# Altium schematic sheet esquematico_ED3.SchDoc
size A4
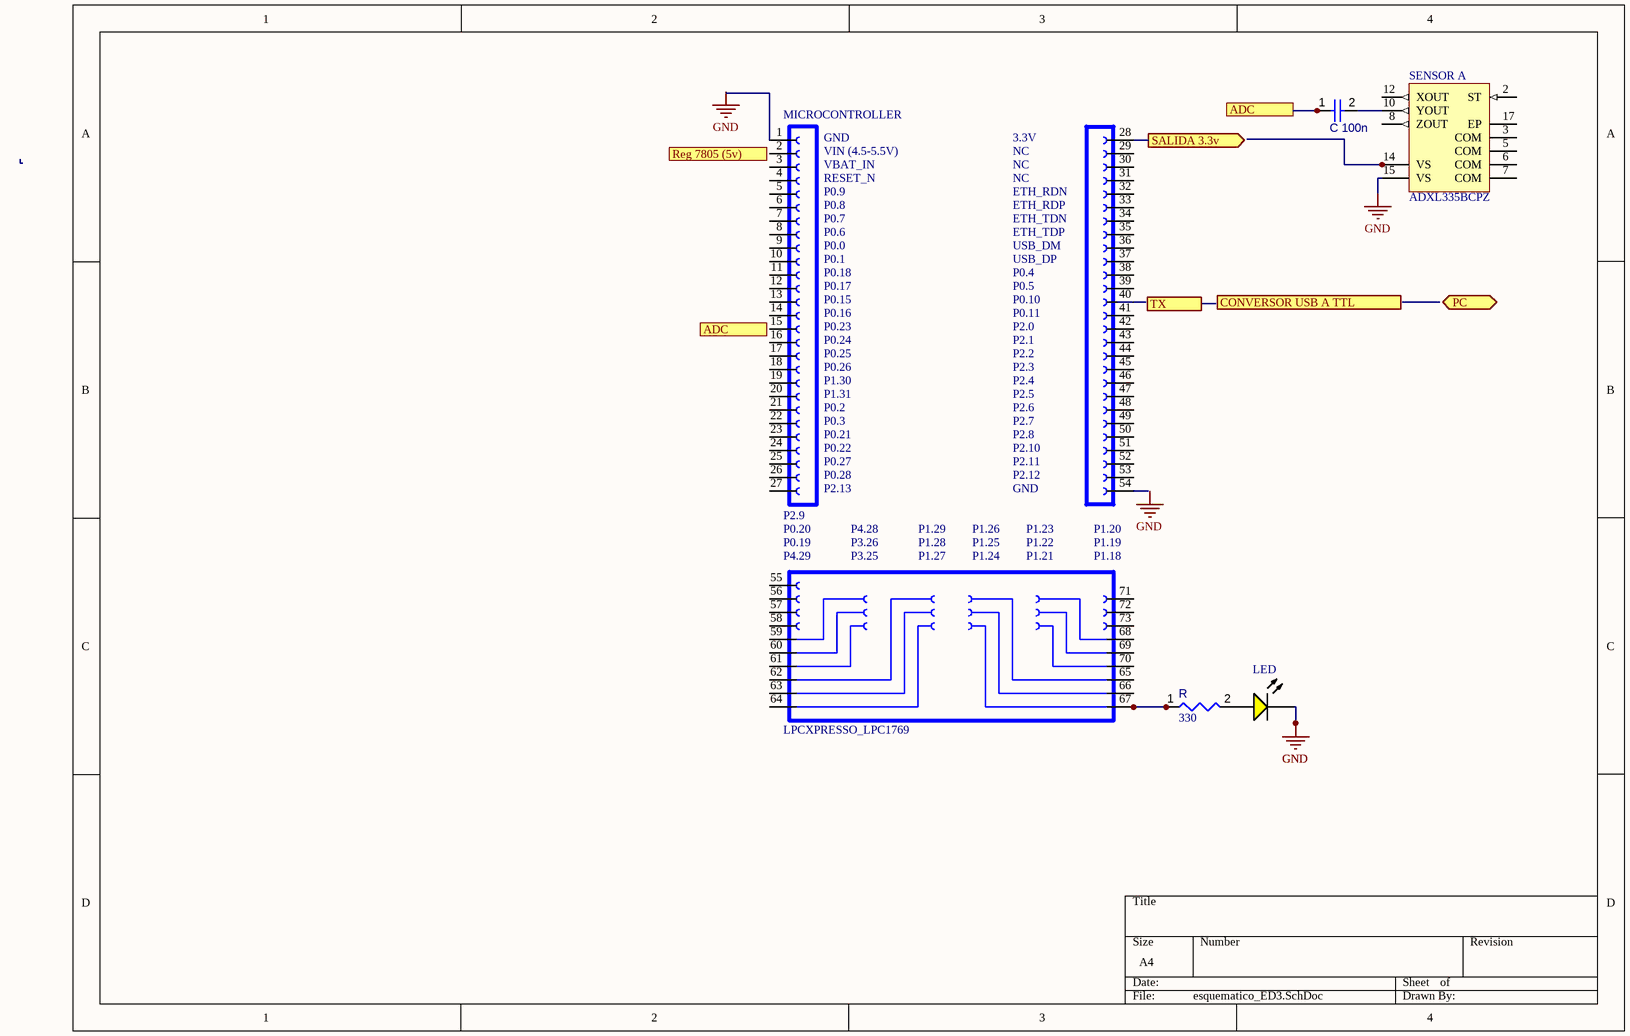
[diagram p0: esquematico_ED3.SchDoc]

## Parts
C_100n  Capacitors  (value not drawn)
LED  (no value)  [VISH-TLMX1100-2_V]
MICROCONTROLLER  LPCXPRESSO_LPC1769  [LPCXPRESSO_LPC1769]
R  value 330  [RESC0402(1005)_L]  (hidden comment: 330R2J)
SENSOR  ADXL335BCPZ  [ADI-CP-16-14_M]  (part A of 2)

## Ports
ADC, CONVERSOR USB A TTL, PC (bidir), Reg 7805 (5v), SALIDA 3.3v (out), TX

## Nets
GND: LED.2(K) SENSOR.15(VS)
SALIDA 3.3v: MICROCONTROLLER.28 ; port SALIDA 3.3v
NetC_100n_2: C_100n.2 SENSOR.10(YOUT)
NetMICROCONTROLLER_67: MICROCONTROLLER.67 R.1

Not connected (* = marked no-connect by the designer): C_100n 1; LED 1(A); MICROCONTROLLER 1 2 3 4 5 6 7 8 9 10 11 12 13 14 15 16 17 18 19 20 21 22 23 24 25 26 27 29 30 31 32 33 34 35 36 37 38 39 40 41 42 43 44 45 46 47 48 49 50 51 52 53 54 55 56 57 58 59 60 61 62 63 64 65 66 68 69 70 71 72 73; R 2; SENSOR 2(ST) 3(COM) 5(COM) 6(COM) 7(COM) 8(ZOUT) 12(XOUT) 14(VS) 17(EP)

## Notes on the sheet
- Labels drawn without touching a wire or pin: GND
- (in symbol LPCXPRESSO_LPC1769) GND; 3.3V; VIN (4.5-5.5V); NC; VBAT_IN; RESET_N; P0.9; ETH_RDN; P0.8; ETH_RDP; P0.7; ETH_TDN; P0.6; ETH_TDP; P0.0; USB_DM; P0.1; USB_DP; P0.18; P0.4; P0.17; P0.5; P0.15; P0.10; P0.16; P0.11; P0.23; P2.0; P0.24; P2.1; P0.25; P2.2; P0.26; P2.3; P1.30; P2.4; P1.31; P2.5; P0.2; P2.6; P0.3; P2.7; P0.21; P2.8; P0.22; P2.10; P0.27; P2.11; P0.28; P2.12; P2.13; P2.9; P0.20; P4.28; P1.29; P1.26; P1.23; P1.20; P0.19; P3.26; P1.28; P1.25; P1.22; P1.19; P4.29; P3.25; P1.27; P1.24; P1.21; P1.18

## Library data of the parts
C_100n = Capacitors: Capacitor; Component Type: Capacitors
LED = CMP-007-00031-2: Yellow LED, 20 mA, 2.1 V, -40 to 100 degC, 2-Pin SMD (0603), RoHS, Tape and Reel; Manufacturer: Vishay Semiconductor; Power: 90mW; Lens Style: Diffused; Nominal Vf: 2.1V; Forward Current: 20mA; Luminous Intensity: 80mcd; Viewing Angle: 160degrees; Manufacturer URL: http://www.vishay.com/; Package Reference: 0603; Packaging: TapeandReel; Case/Package: 0603; Datasheet Version: Rev. 2.7, 03/2016; Package Quantity: 3000; Forward Voltage: 2.1V; RoHS Compliant: True; Mounting Technology: SM; Datasheet URL: http://download.siliconexpert.com/pdfs/2016/8/7/12/43/26/667/vsh_/manual/379263299541529tlmb1100.pdf; Min Operating Temperature: -40°C; Pins: 2; Package Description: 2-Pin Surface Mount Device, Body 1.6 x 0.8 mm; Colour: Yellow; Max Operating Temperature: 100°C; Illumination Colour: Yellow
MICROCONTROLLER = LPCXPRESSO_LPC1769: LPC1768, LPC1769, mbed-Enabled Development LPCXpressoâ„¢ LPC1700 ARMÂ® CortexÂ®-M3 MCU 32-Bit Embedded Evaluation Board; MF: Embedded Artists; MP: LPCXPRESSO LPC1769; SnapEDA_Link: https://www.snapeda.com/parts/LPCXPRESSO%20LPC1769/Embedded%20Artists/view-part/45270/?ref=snap; Value: *; Check_prices: https://www.snapeda.com/parts/LPCXPRESSO%20LPC1769/Embedded%20Artists/view-part/45270/?ref=eda; Package: None; Availability: Unavailable; Price: None
R = CMP-009-00095-2: 330R 0.063W 5% 0402 (1005 Metric)  SMD; Power: 63mW; Tolerance: 5%; Mounting Technology: SMT; Case/Package: 0402; Pins: 2
SENSOR = CMP-010-00000-3: Small, Low Power, 3-Axis +/-3 g Accelerometer with Analog Output, 1.6 KHz BW, Industrial, 16-Pin QFN, Tray; Manufacturer: Analog Devices; Min Supply Voltage: 1.8V; Package Version: 051909-A, 05/2009; Max Supply Voltage: 3.6V; Sensor Type: Motion; Nominal Supply Current: 350µA; Package Description: 16-Pin Lead Frame Chip Scale Package, 4 x 4 mm Body, 0.65 mm Pitch; Min Operating Temperature: -40°C; Case/Package: PDIP; Datasheet Version: Rev. B, 01/2010; Package Quantity: 490; Package Reference: CP-16-14; Mounting Technology: SM; Packaging: Tray; Datasheet URL: http://www.analog.com/static/imported-files/data_sheets/ADXL335.pdf; Pins: 16; Max Operating Temperature: 85°C; RoHS Compliant: True